# EasyEDA schematic SCH_WS2812B-IR-Controller_2024-06-23.json
TITLE: WS2812B Controller; REV: 1.0; Date: 2024-06-23; Sheet: 1/1; Drawn By: Rajdeep
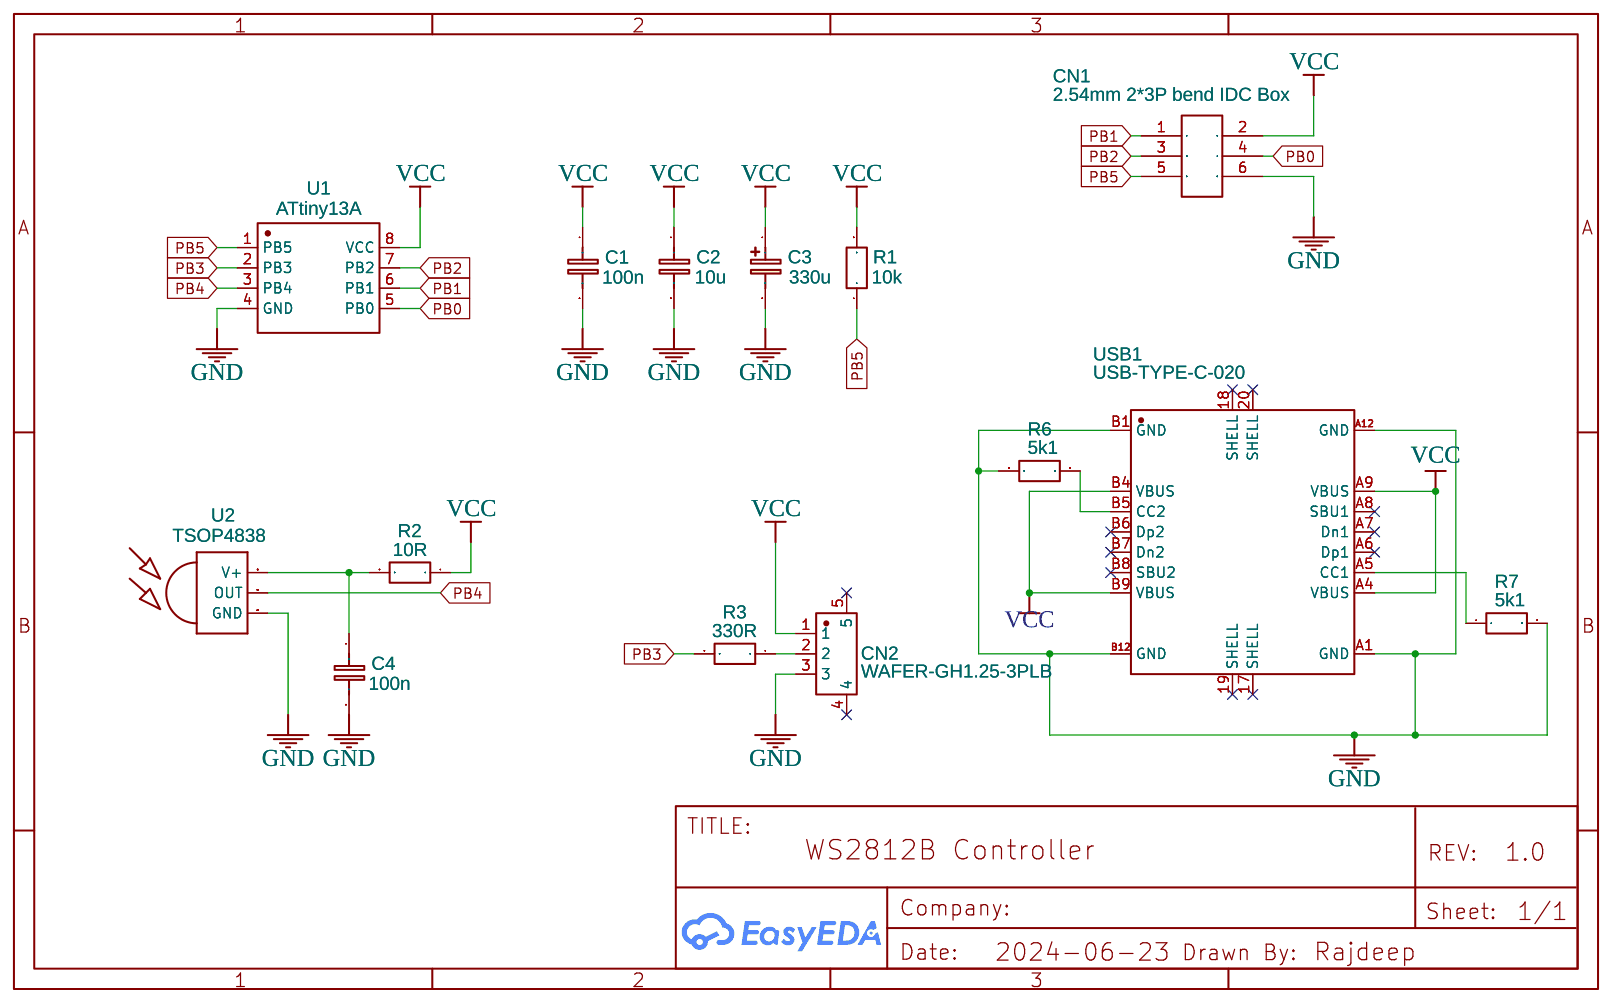
[diagram p0: schematic sheet]

## Parts
C1  100n  [0603]
C2  10u  [0603]
C3  330u  [TANTALUM_CASE-D]
C4  100n  [0603]
CN1  2.54mm 2*3P bend IDC Box  [IDC-TH_6P-P2.54-H-R2-C3-S2.54]
CN2  WAFER-GH1.25-3PLB  [CONN-SMD_3P-P1.25_XUNPU_WAFER-GH1.25-3PLB]
R1  10k  [0603]
R2  10R  [0603]
R3  330R  [0603]
R6  5k1  [0603]
R7  5k1  [0603]
U1  ATtiny13A  [SOP-8_150MIL]
U2  TSOP4838  [TSOP18XX]
USB1  USB-TYPE-C-020  [USB-SMD_USB-TYPE-C-020]

## Library data of the parts
C1 C4 = Cap_0603_EU: Manufacturer Part: CC0603KRX7R9BB104; Supplier: LCSC; Manufacturer: YAGEO; Supplier Part: C14663
C2 = Cap_0603_EU: Manufacturer Part: CL10A106MA8NRNC; Supplier: LCSC; Manufacturer: SAMSUNG; Supplier Part: C96446
C3 = Cap_Tantalum(SMD)_D-7343_EU: Contributor: EasyEDA; Manufacturer Part: TAJD337M010RNJ; Supplier: LCSC; Manufacturer: AVX; Supplier Part: C105408
CN1 = 2.54mm 2*3P bend IDC Box: Supplier: LCSC; Manufacturer: BOOMELE(博穆精密); Manufacturer Part: 2.54-2*3P弯简牛; Supplier Part: C34945; JLCPCB Part Class: Extended Part
CN2 = WAFER-GH1.25-3PLB: Contributor: lcsc; Supplier: LCSC; Supplier Part: C3029369; Manufacturer: XUNPU(讯普); JLCPCB Part Class: Extended Part
R1 = Res_0603(1/10W)_EU: Manufacturer Part: 0603WAF1002T5E; Supplier: LCSC; Manufacturer: UniOhm; Supplier Part: C25804
R2 = Res_0603(1/10W)_EU: Manufacturer Part: 0603WAF100JT5E; Supplier: LCSC; Manufacturer: UniOhm; Supplier Part: C22859
R3 = Res_0603(1/10W)_EU: Manufacturer Part: 0603WAF3300T5E; Supplier: LCSC; Manufacturer: UniOhm; Supplier Part: C23138
R6 R7 = Res_0603(1/10W)_EU: Manufacturer Part: 0603WAF5101T5E; Supplier: LCSC; Manufacturer: UniOhm; Supplier Part: C23186
U1 = -: Supplier: LCSC; Manufacturer: MICROCHIP; Manufacturer Part: ATTINY13A-SSU; Supplier Part: C14075
U2 = TSOP4856: Supplier Part: C124647; Supplier: LCSC; Contributor: Stefan Wagner; Manufacturer: VISHAY
USB1 = USB-TYPE-C-020: Supplier: LCSC; Supplier Part: C2927040; Manufacturer: DEALON(德艺隆); Contributor: lcsc

## Nets
GND: C1.2 C2.2 C3.2 C4.2 CN1.6 CN2.3 R6.1 R7.2 U1.4(GND) U2.GND USB1.A1(GND) USB1.A12(GND) USB1.B1(GND) USB1.B12(GND)
VCC: C1.1 C2.1 C3.1 CN1.2 CN2.1 R1.2 R2.1 U1.8(VCC) USB1.A4(VBUS) USB1.A9(VBUS) USB1.B4(VBUS) USB1.B9(VBUS)
PB0: CN1.4 U1.5(PB0)
PB1: CN1.1 U1.6(PB1)
PB2: CN1.3 U1.7(PB2)
PB3: R3.2 U1.2(PB3)
PB4: U1.3(PB4) U2.OUT
PB5: CN1.5 R1.1 U1.1(PB5)
Net-(C4-1): C4.1 R2.2 U2.VCC(V+)
Net-(CN2-2): CN2.2 R3.1
Net-(R6-2): R6.2 USB1.B5(CC2)
Net-(R7-1): R7.1 USB1.A5(CC1)

Not connected (* = marked no-connect by the designer): CN2 4* 5*; USB1 17(SHELL)* 18(SHELL)* 19(SHELL)* 20(SHELL)* A6(Dp1)* A7(Dn1)* A8(SBU1)* B6(Dp2)* B7(Dn2)* B8(SBU2)*
